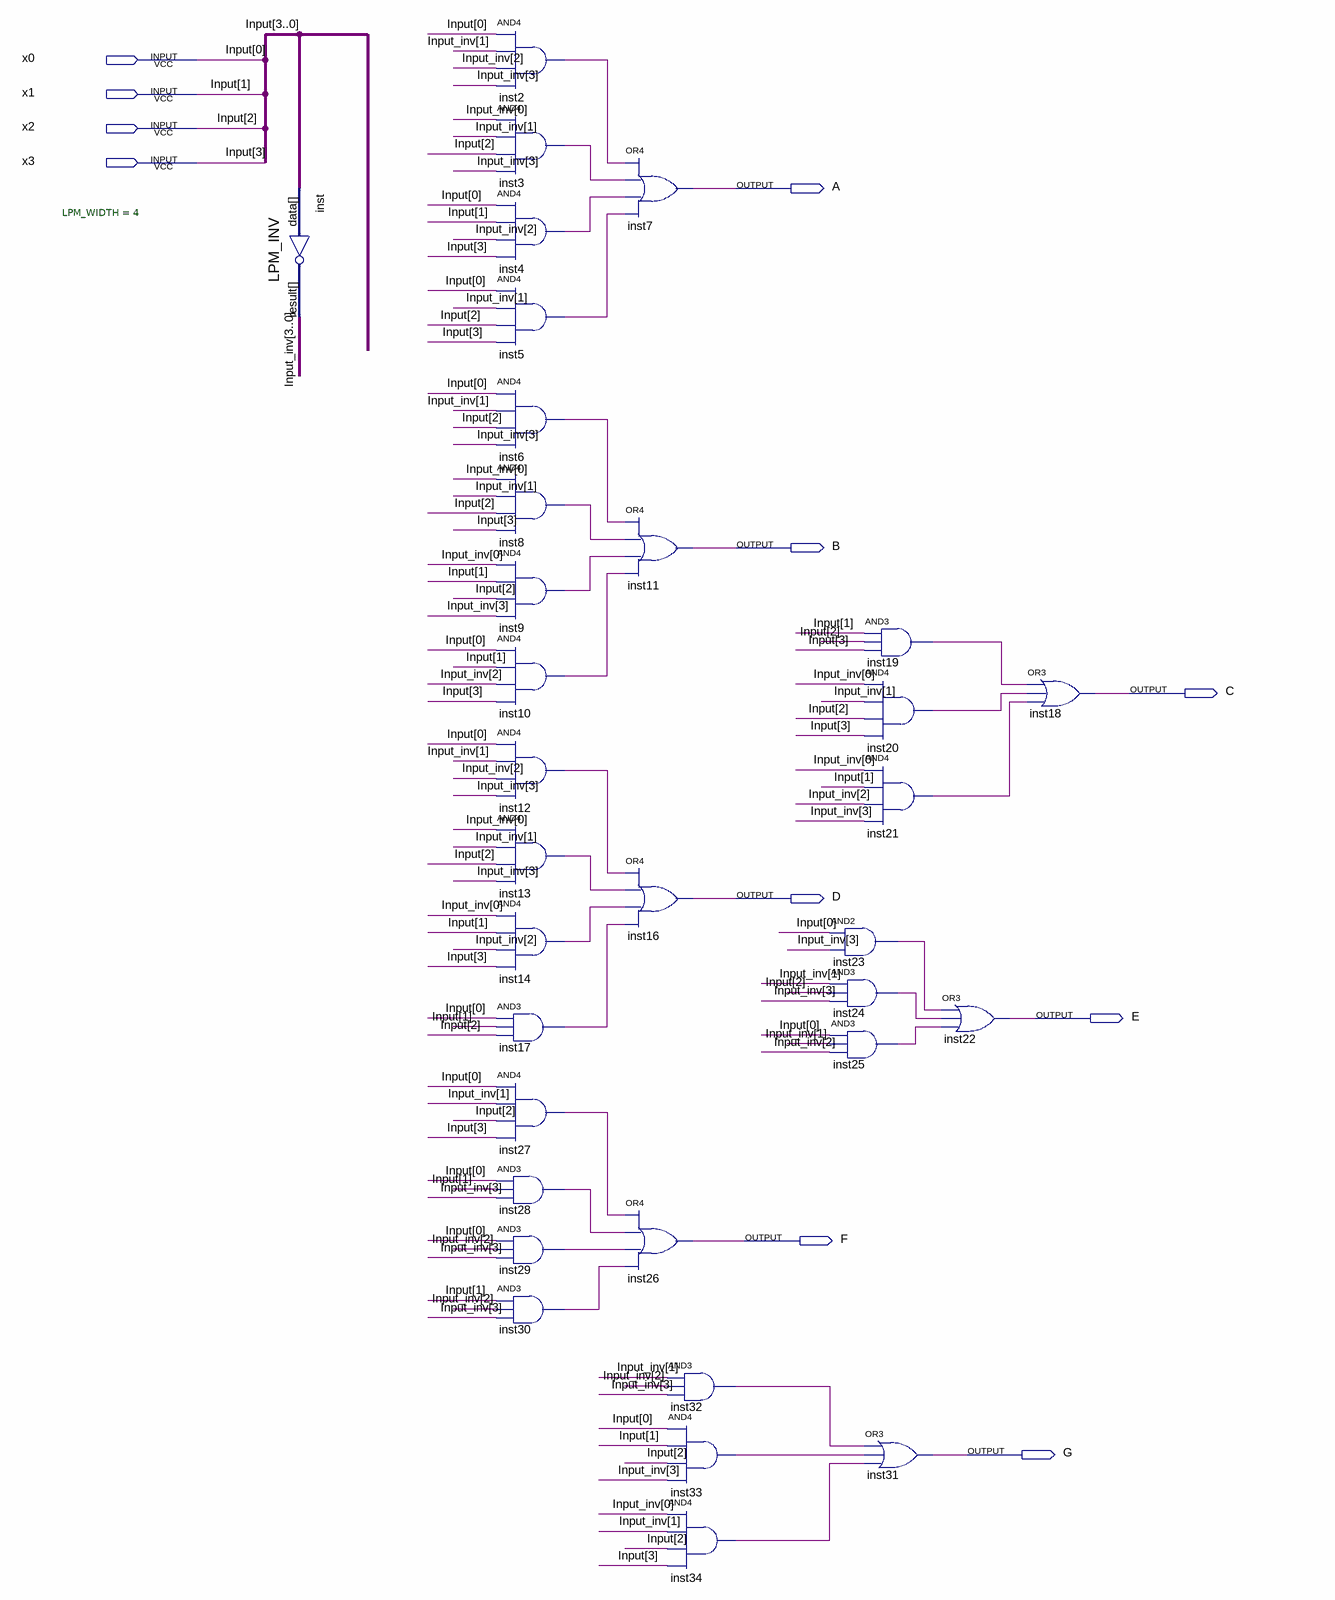
[diagram p0: schematic sheet]
// Quartus schematic DEC_SEM.bdf as structural Verilog: 33 symbols, 11 pins
module DEC_SEM (
  input  x0,
  input  x1,
  input  x2,
  input  x3,
  output A,
  output B,
  output C,
  output D,
  output E,
  output F,
  output G
);

  wire inst2_out, inst3_out, inst4_out, inst5_out, inst6_out, inst8_out, inst9_out, inst10_out, inst12_out,
       inst13_out, inst14_out, inst17_out, inst19_out, inst20_out, inst21_out, inst23_out, inst24_out,
       inst25_out, inst27_out, inst28_out, inst29_out, inst30_out, inst32_out, inst33_out, inst34_out;
  wire [3:0] Input_inv;

  LPM_INV #(.LPM_WIDTH(4)) inst (.data({x3, x2, x1, x0}), .result(Input_inv));
  and inst2 (inst2_out, x0, Input_inv[1], Input_inv[2], Input_inv[3]);
  and inst3 (inst3_out, Input_inv[0], Input_inv[1], x2, Input_inv[3]);
  and inst4 (inst4_out, x0, x1, Input_inv[2], x3);
  and inst5 (inst5_out, x0, Input_inv[1], x2, x3);
  and inst6 (inst6_out, x0, Input_inv[1], x2, Input_inv[3]);
  and inst8 (inst8_out, Input_inv[0], Input_inv[1], x2, x3);
  and inst9 (inst9_out, Input_inv[0], x1, x2, Input_inv[3]);
  and inst10 (inst10_out, x0, x1, Input_inv[2], x3);
  and inst12 (inst12_out, x0, Input_inv[1], Input_inv[2], Input_inv[3]);
  and inst13 (inst13_out, Input_inv[0], Input_inv[1], x2, Input_inv[3]);
  and inst14 (inst14_out, Input_inv[0], x1, Input_inv[2], x3);
  and inst17 (inst17_out, x0, x1, x2);
  and inst27 (inst27_out, x0, Input_inv[1], x2, x3);
  and inst28 (inst28_out, x0, x1, Input_inv[3]);
  and inst29 (inst29_out, x0, Input_inv[2], Input_inv[3]);
  and inst30 (inst30_out, x1, Input_inv[2], Input_inv[3]);
  or inst7 (A, inst2_out, inst3_out, inst4_out, inst5_out);
  or inst11 (B, inst6_out, inst8_out, inst9_out, inst10_out);
  or inst16 (D, inst12_out, inst13_out, inst14_out, inst17_out);
  or inst26 (F, inst27_out, inst28_out, inst29_out, inst30_out);
  and inst32 (inst32_out, Input_inv[1], Input_inv[2], Input_inv[3]);
  and inst33 (inst33_out, x0, x1, x2, Input_inv[3]);
  and inst34 (inst34_out, Input_inv[0], Input_inv[1], x2, x3);
  and inst19 (inst19_out, x1, x2, x3);
  and inst20 (inst20_out, Input_inv[0], Input_inv[1], x2, x3);
  and inst21 (inst21_out, Input_inv[0], x1, Input_inv[2], Input_inv[3]);
  and inst23 (inst23_out, x0, Input_inv[3]);
  and inst24 (inst24_out, Input_inv[1], x2, Input_inv[3]);
  and inst25 (inst25_out, x0, Input_inv[1], Input_inv[2]);
  or inst31 (G, inst32_out, inst33_out, inst34_out);
  or inst22 (E, inst23_out, inst24_out, inst25_out);
  or inst18 (C, inst19_out, inst20_out, inst21_out);

  // Other names for the same wires on the sheet: Input[3:0] = {x3, x2, x1, x0}
endmodule
